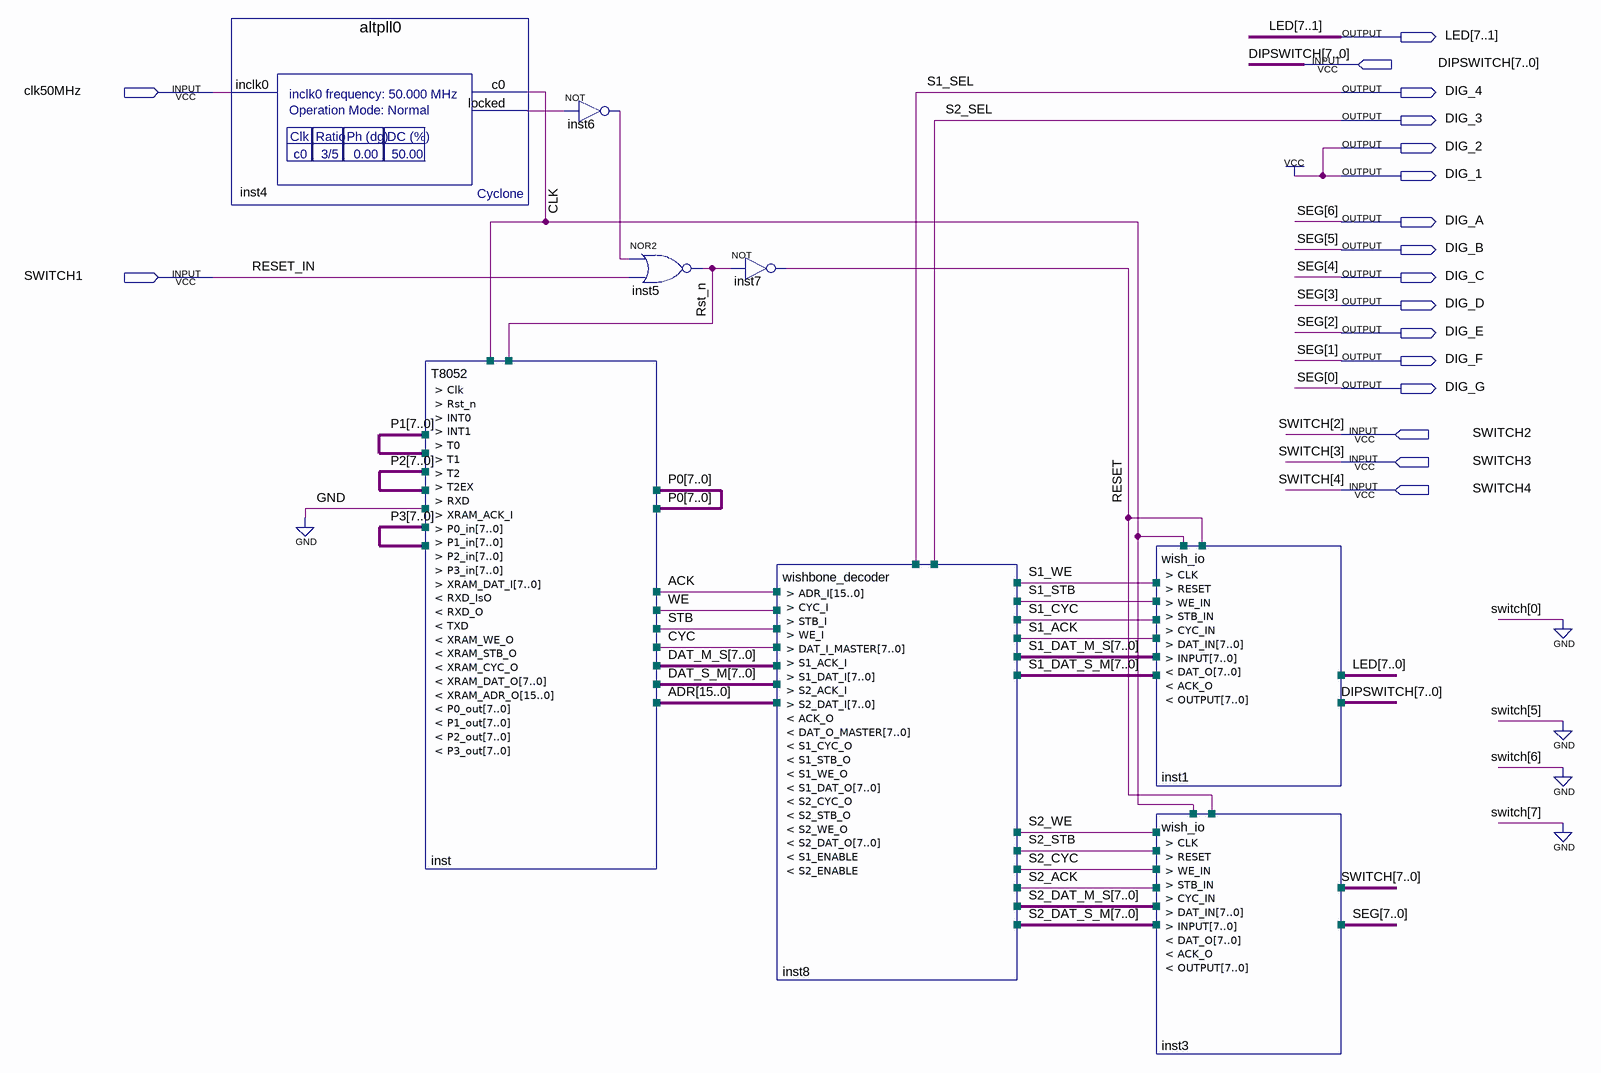
[diagram p0: schematic sheet]
// Quartus schematic ex14.bdf as structural Verilog: 8 symbols, 18 pins
module ex14 (
  input  [7:0] DIPSWITCH,
  input  clk50MHz,
  input  SWITCH1,
  input  SWITCH2,
  input  SWITCH3,
  input  SWITCH4,
  output [7:0] LED,
  output DIG_4,
  output DIG_3,
  output DIG_2,
  output DIG_1,
  output DIG_A,
  output DIG_B,
  output DIG_C,
  output DIG_D,
  output DIG_E,
  output DIG_F,
  output DIG_G
);

  wire ACK, CLK, CYC, inst4_locked, inst6_out, RESET, Rst_n, S1_ACK, S1_CYC, S1_STB, S1_WE, S2_ACK, S2_CYC,
       S2_STB, S2_WE, STB, WE;
  wire [7:0] DAT_M_S, DAT_S_M, P0, P1, P2, P3, S1_DAT_M_S, S1_DAT_S_M, S2_DAT_M_S, S2_DAT_S_M;
  wire [7:7] SEG;
  wire [15:0] ADR;

  altpll0 inst4 (.inclk0(clk50MHz), .c0(CLK), .locked(inst4_locked));
  T8052 inst (
    .Clk(CLK), .Rst_n(Rst_n), .INT0(1'b0), .INT1(1'b0), .T0(1'b0), .T1(1'b0), .T2(1'b0), .T2EX(1'b0),
    .RXD(1'b0), .XRAM_ACK_I(ACK), .P0_in(P0), .P1_in(P1), .P2_in(P2), .P3_in(P3), .XRAM_DAT_I(DAT_S_M),
    .XRAM_WE_O(WE), .XRAM_STB_O(STB), .XRAM_CYC_O(CYC), .XRAM_DAT_O(DAT_M_S), .XRAM_ADR_O(ADR), .P0_out(P0),
    .P1_out(P1), .P2_out(P2), .P3_out(P3));  // open: RXD_IsO, RXD_O, TXD
  not inst6 (inst6_out, inst4_locked);
  nor inst5 (Rst_n, inst6_out, SWITCH1);
  not inst7 (RESET, Rst_n);
  wishbone_decoder inst8 (
    .ADR_I(ADR), .CYC_I(CYC), .STB_I(STB), .WE_I(WE), .DAT_I_MASTER(DAT_M_S), .S1_ACK_I(S1_ACK),
    .S1_DAT_I(S1_DAT_S_M), .S2_ACK_I(S2_ACK), .S2_DAT_I(S2_DAT_S_M), .ACK_O(ACK), .DAT_O_MASTER(DAT_S_M),
    .S1_CYC_O(S1_CYC), .S1_STB_O(S1_STB), .S1_WE_O(S1_WE), .S1_DAT_O(S1_DAT_M_S), .S2_CYC_O(S2_CYC),
    .S2_STB_O(S2_STB), .S2_WE_O(S2_WE), .S2_DAT_O(S2_DAT_M_S), .S1_ENABLE(DIG_4), .S2_ENABLE(DIG_3));
  wish_io inst1 (
    .CLK(CLK), .RESET(RESET), .WE_IN(S1_WE), .STB_IN(S1_STB), .CYC_IN(S1_CYC), .DAT_IN(S1_DAT_M_S),
    .INPUT(DIPSWITCH), .DAT_O(S1_DAT_S_M), .ACK_O(S1_ACK), .OUTPUT(LED));
  wish_io inst3 (
    .CLK(CLK), .RESET(RESET), .WE_IN(S2_WE), .STB_IN(S2_STB), .CYC_IN(S2_CYC), .DAT_IN(S2_DAT_M_S),
    .INPUT({3'b000, SWITCH4, SWITCH3, SWITCH2, SWITCH1, 1'b0}), .DAT_O(S2_DAT_S_M), .ACK_O(S2_ACK),
    .OUTPUT({SEG[7], DIG_A, DIG_B, DIG_C, DIG_D, DIG_E, DIG_F, DIG_G}));

  assign DIG_1 = 1'b1;
  assign DIG_2 = 1'b1;

  // Other names for the same wires on the sheet: S1_SEL = DIG_4; S2_SEL = DIG_3;
  //   SEG[6:0] = {DIG_A, DIG_B, DIG_C, DIG_D, DIG_E, DIG_F, DIG_G}; RESET_IN = SWITCH1
endmodule
